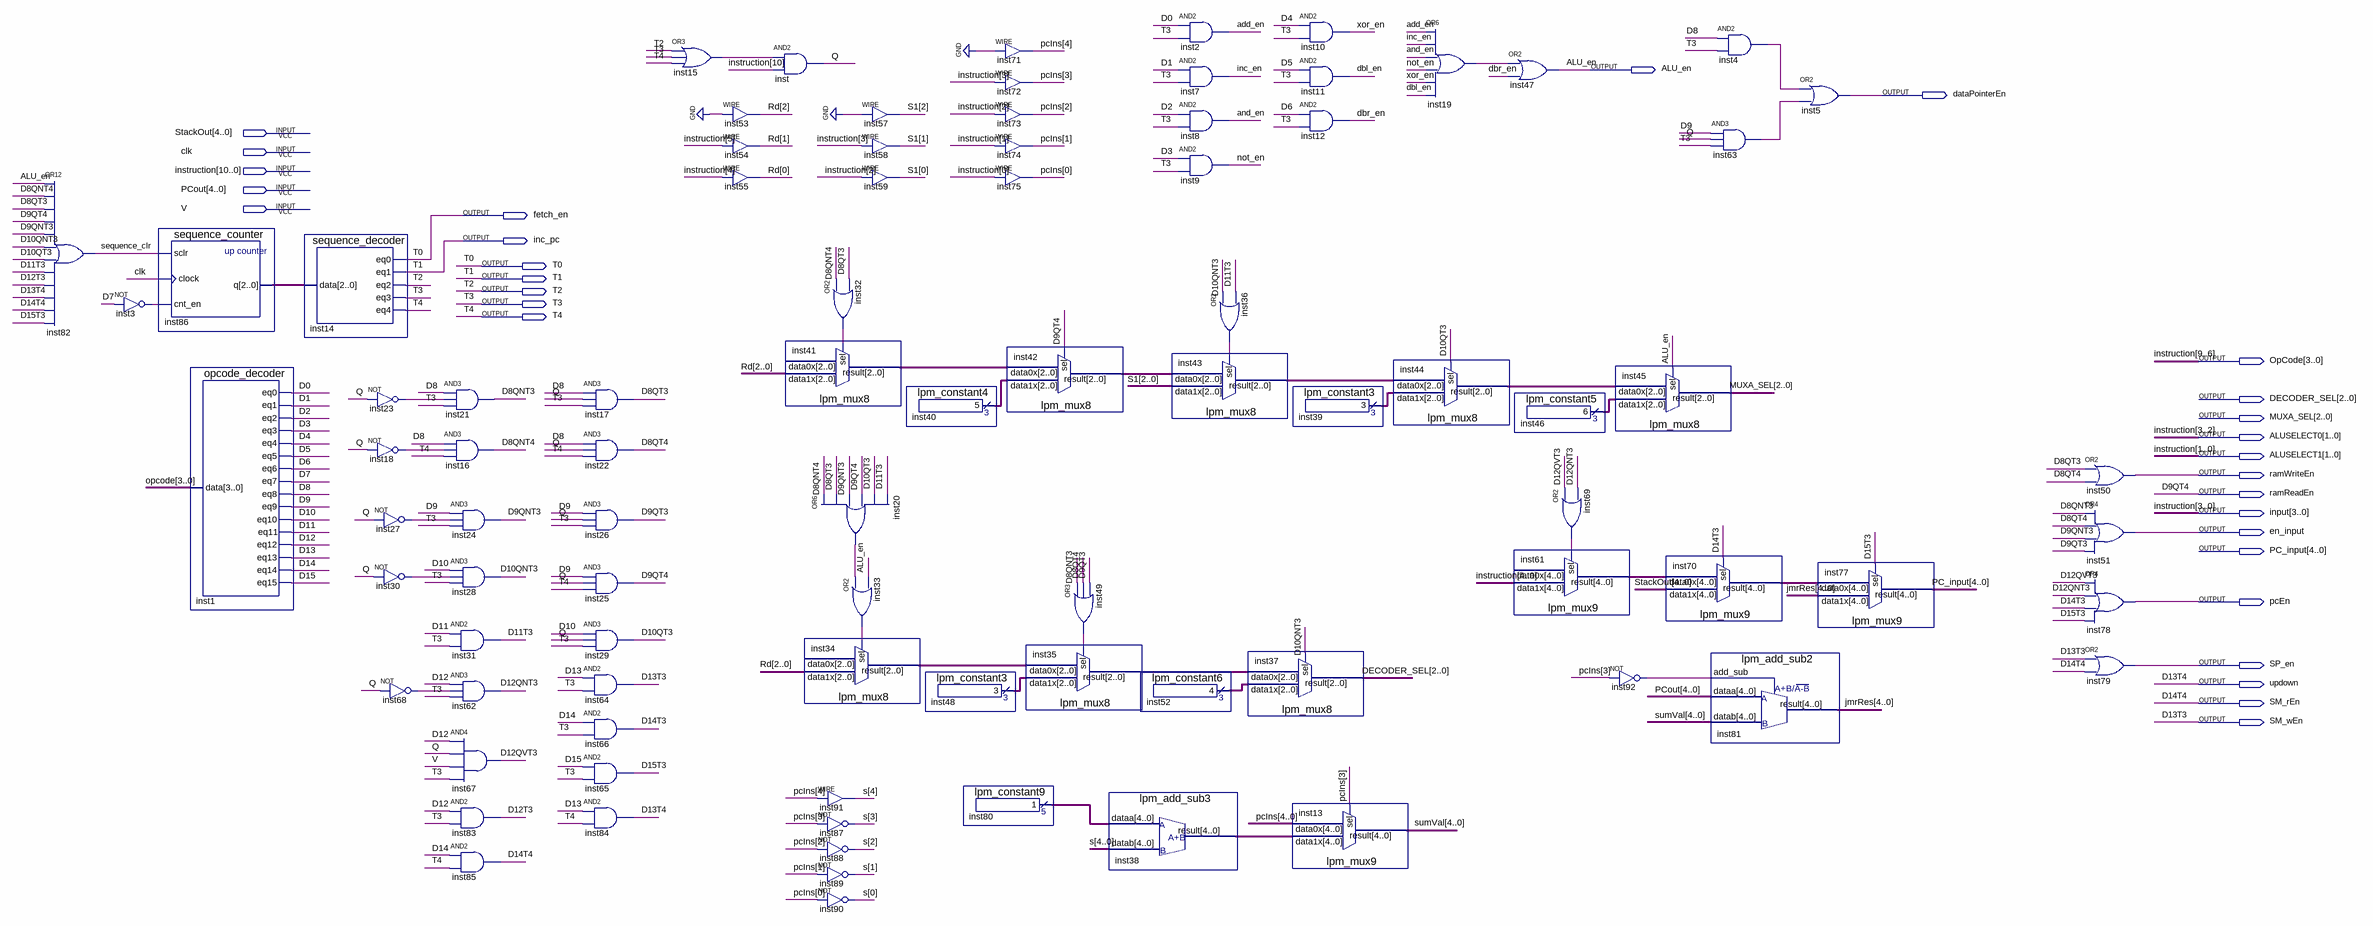
[diagram p0: schematic sheet]
// Quartus schematic group4_poyrazbatu_irmak_2023510155_ControlUnit.bdf as structural Verilog: 89 symbols, 29 pins
module group4_poyrazbatu_irmak_2023510155_ControlUnit (
  input  [4:0] StackOut,
  input  clk,
  input  [10:0] instruction,
  input  [4:0] PCout,
  input  V,
  output ALU_en,
  output dataPointerEn,
  output fetch_en,
  output inc_pc,
  output T0,
  output T1,
  output T2,
  output T3,
  output T4,
  output [3:0] OpCode,
  output [2:0] DECODER_SEL,
  output [2:0] MUXA_SEL,
  output [1:0] ALUSELECT0,
  output [1:0] ALUSELECT1,
  output ramWriteEn,
  output ramReadEn,
  output [3:0] \input ,
  output en_input,
  output [4:0] PC_input,
  output pcEn,
  output SP_en,
  output updown,
  output SM_rEn,
  output SM_wEn
);

  wire add_en, and_en, D0, D1, D2, D3, D4, D5, D6, D7, D8, D8QNT3, D8QNT4, D8QT3, D8QT4, D9, D9QNT3, D9QT3,
       D10, D10QNT3, D10QT3, D11, D11T3, D12, D12QNT3, D12QVT3, D12T3, D13, D14, D14T3, D15, D15T3, dbl_en,
       dbr_en, inc_en, inst3_out, inst4_out, inst15_out, inst18_out, inst19_out, inst20_out, inst23_out,
       inst27_out, inst30_out, inst32_out, inst33_out, inst36_out, inst49_out, inst63_out, inst68_out,
       inst69_out, inst92_out, not_en, Q, sequence_clr, xor_en;
  wire [2:0] inst34_result, inst35_result, inst39_result, inst40_result, inst41_result, inst42_result,
       inst43_result, inst44_result, inst46_result, inst48_result, inst52_result, inst86_q, Rd, S1;
  wire [4:0] inst38_result, inst61_result, inst70_result, inst80_result, jmrRes, pcIns, s, sumVal;

  or inst82 (sequence_clr, ALU_en, D8QNT4, D8QT3, ramReadEn, D9QNT3, D10QNT3, D10QT3, D11T3, D12T3, updown, SM_rEn, D15T3);
  not inst3 (inst3_out, D7);
  sequence_counter inst86 (.sclr(sequence_clr), .clock(clk), .cnt_en(inst3_out), .q(inst86_q));
  opcode_decoder inst1 (
    .data(instruction[9:6]), .eq0(D0), .eq1(D1), .eq2(D2), .eq3(D3), .eq4(D4), .eq5(D5), .eq6(D6), .eq7(D7),
    .eq8(D8), .eq9(D9), .eq10(D10), .eq11(D11), .eq12(D12), .eq13(D13), .eq14(D14), .eq15(D15));
  sequence_decoder inst14 (.data(inst86_q), .eq0(fetch_en), .eq1(inc_pc), .eq2(T2), .eq3(T3), .eq4(T4));
  not inst23 (inst23_out, Q);
  not inst18 (inst18_out, Q);
  not inst27 (inst27_out, Q);
  not inst30 (inst30_out, Q);
  not inst68 (inst68_out, Q);
  and inst21 (D8QNT3, D8, inst23_out, T3);
  and inst16 (D8QNT4, D8, inst18_out, T4);
  and inst24 (D9QNT3, D9, inst27_out, T3);
  and inst28 (D10QNT3, D10, inst30_out, T3);
  and inst31 (D11T3, D11, T3);
  and inst62 (D12QNT3, D12, inst68_out, T3);
  and inst67 (D12QVT3, D12, Q, V, T3);
  and inst83 (D12T3, D12, T3);
  and inst85 (SM_rEn, D14, T4);
  and inst17 (D8QT3, D8, Q, T3);
  and inst22 (D8QT4, D8, Q, T4);
  and inst26 (D9QT3, D9, Q, T3);
  and inst25 (ramReadEn, D9, Q, T4);
  and inst29 (D10QT3, D10, Q, T3);
  and inst64 (SM_wEn, D13, T3);
  and inst66 (D14T3, D14, T3);
  and inst65 (D15T3, D15, T3);
  and inst84 (updown, D13, T4);
  or inst15 (inst15_out, T2, T3, T4);
  assign Rd[2] = 1'b0;  // WIRE inst53
  assign Rd[1] = instruction[5];  // WIRE inst54
  assign Rd[0] = instruction[4];  // WIRE inst55
  and inst (Q, inst15_out, instruction[10]);
  or inst32 (inst32_out, D8QNT4, D8QT3);
  lpm_mux8 inst41 (.data1x(Rd), .sel(inst32_out), .result(inst41_result));  // open: data0x
  or inst20 (inst20_out, D8QNT4, D8QT3, D9QNT3, ramReadEn, D10QT3, D11T3);
  lpm_mux8 inst34 (.data1x(Rd), .sel(inst33_out), .result(inst34_result));  // open: data0x
  assign s[4] = pcIns[4];  // WIRE inst91
  not inst87 (s[3], pcIns[3]);
  not inst88 (s[2], pcIns[2]);
  not inst89 (s[1], pcIns[1]);
  not inst90 (s[0], pcIns[0]);
  assign S1[2] = 1'b0;  // WIRE inst57
  assign S1[1] = instruction[3];  // WIRE inst58
  assign S1[0] = instruction[2];  // WIRE inst59
  or inst33 (inst33_out, inst20_out, ALU_en);
  lpm_constant4 inst40 (.result(inst40_result));
  lpm_constant3 inst48 (.result(inst48_result));
  lpm_constant9 inst80 (.result(inst80_result));
  assign pcIns[4] = 1'b0;  // WIRE inst71
  assign pcIns[3] = instruction[3];  // WIRE inst72
  assign pcIns[2] = instruction[2];  // WIRE inst73
  assign pcIns[1] = instruction[1];  // WIRE inst74
  assign pcIns[0] = instruction[0];  // WIRE inst75
  lpm_mux8 inst42 (.data1x(inst40_result), .data0x(inst41_result), .sel(ramReadEn), .result(inst42_result));
  lpm_mux8 inst35 (.data1x(inst48_result), .data0x(inst34_result), .sel(inst49_out), .result(inst35_result));
  or inst49 (inst49_out, D8QNT3, D8QT4, D9QT3);
  lpm_add_sub3 inst38 (.dataa(inst80_result), .datab(s), .result(inst38_result));
  and inst2 (add_en, D0, T3);
  and inst7 (inc_en, D1, T3);
  and inst8 (and_en, D2, T3);
  and inst9 (not_en, D3, T3);
  lpm_mux8 inst43 (.data1x(S1), .data0x(inst42_result), .sel(inst36_out), .result(inst43_result));
  lpm_constant6 inst52 (.result(inst52_result));
  or inst36 (inst36_out, D10QNT3, D11T3);
  lpm_mux8 inst37 (.data1x(inst52_result), .data0x(inst35_result), .sel(D10QNT3), .result(DECODER_SEL));
  and inst10 (xor_en, D4, T3);
  and inst11 (dbl_en, D5, T3);
  and inst12 (dbr_en, D6, T3);
  lpm_constant3 inst39 (.result(inst39_result));
  lpm_mux9 inst13 (.data1x(inst38_result), .data0x(pcIns), .sel(pcIns[3]), .result(sumVal));
  or inst19 (inst19_out, add_en, inc_en, and_en, not_en, xor_en, dbl_en);
  lpm_mux8 inst44 (.data1x(inst39_result), .data0x(inst43_result), .sel(D10QT3), .result(inst44_result));
  or inst47 (ALU_en, inst19_out, dbr_en);
  lpm_constant5 inst46 (.result(inst46_result));
  lpm_mux9 inst61 (.data1x(instruction[4:0]), .sel(inst69_out), .result(inst61_result));  // open: data0x
  or inst69 (inst69_out, D12QVT3, D12QNT3);
  lpm_mux8 inst45 (.data1x(inst46_result), .data0x(inst44_result), .sel(ALU_en), .result(MUXA_SEL));
  not inst92 (inst92_out, pcIns[3]);
  lpm_mux9 inst70 (.data1x(StackOut), .data0x(inst61_result), .sel(D14T3), .result(inst70_result));
  and inst4 (inst4_out, D8, T3);
  and inst63 (inst63_out, D9, Q, T3);
  lpm_add_sub2 inst81 (.add_sub(inst92_out), .dataa(PCout), .datab(sumVal), .result(jmrRes));
  or inst5 (dataPointerEn, inst4_out, inst63_out);
  lpm_mux9 inst77 (.data1x(jmrRes), .data0x(inst70_result), .sel(D15T3), .result(PC_input));
  or inst50 (ramWriteEn, D8QT3, D8QT4);
  or inst51 (en_input, D8QNT3, D8QT4, D9QNT3, D9QT3);
  or inst78 (pcEn, D12QVT3, D12QNT3, D14T3, D15T3);
  or inst79 (SP_en, SM_wEn, SM_rEn);

  assign ALUSELECT0 = instruction[3:2];
  assign ALUSELECT1 = instruction[1:0];
  assign \input  = instruction[3:0];
  assign OpCode = instruction[9:6];
  assign T0 = fetch_en;
  assign T1 = inc_pc;

  // Other names for the same wires on the sheet: D9QT4 = ramReadEn; D13T3 = SM_wEn; D13T4 = updown; D14T4 = SM_rEn
endmodule
